# Altium schematic sheet 4V_DIST.SchDoc: My title
size A3; Organization: University of California; Address1: 475 Portola Plaza; Address2: Los Angeles, CA 90095; DocumentNumber: 5; Revision: R01; SheetNumber: 5; SheetTotal: 35
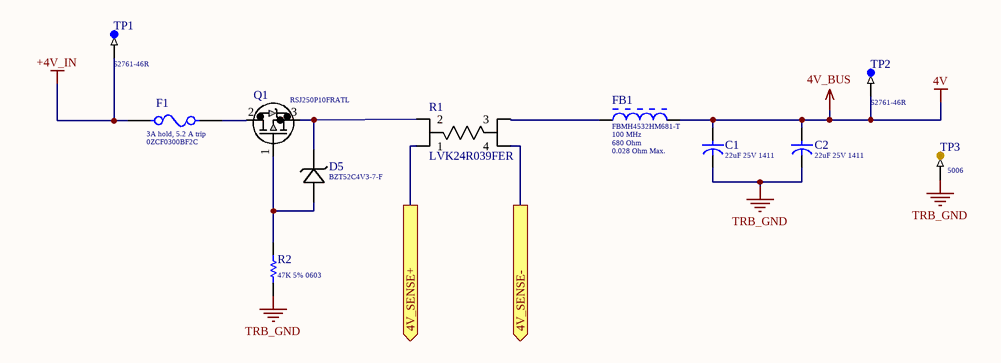
[diagram p0: 4V_DIST.SchDoc]

## Parts
C1  Capacitance: 22uF 25V 1411  [Cap_Kemet_T521B226M025ATE100_22uF]  (hidden comment: Cap_Kemet_T521B226M025ATE100_22uF)
C2  Capacitance: 22uF 25V 1411  [Cap_Kemet_T521B226M025ATE100_22uF]  (hidden comment: Cap_Kemet_T521B226M025ATE100_22uF)
D5  BZT52C4V3-7-F  [SOD123]
F1  3A hold, 5.2 A trip  [Bel_0ZCF_MFG]
FB1  Measuring Frequency: 100 MHz  Nominal Impedance: 680 Ohm  DC Resistance: 0.028 Ohm Max.  [TAYO-FBMH4532-2_V]  (hidden comment: FBMH4532HM681-T)
Q1  Series: RSJ250P10FRATL  [Mos_ROHM_RSJ250P10FRATL_25A]  (hidden comment: Mos_ROHM_RSJ250P10FRATL_25A)
R1  LVK24R039FER  [OH_LVK24_OHM]
R2  47K 5% 0603  [RESC0603(1608)_L]
TP1  Series: S2761-46R  [TP_Harwin_S2761_46R]  (hidden comment: TP_Harwin_S2761_46R)
TP2  Series: S2761-46R  [TP_Harwin_S2761_46R]  (hidden comment: TP_Harwin_S2761_46R)
TP3  Series: 5006  [TP_Keystone_Electronics_5006]  (hidden comment: TP_Keystone_Electronics_5006)

## Ports
4V_SENSE+ (out), 4V_SENSE- (out)

## Nets
4V: C1.1 C2.1 FB1.2 TP2.1  [also labelled 4V_BUS]
+4V_IN: F1.1 TP1.1
TRB_GND: C1.2 C2.2 R2.1 TP3.1
4V_SENSE+: R1.1 ; port 4V_SENSE+
4V_SENSE-: R1.4 ; port 4V_SENSE-
NetD5_1: D5.1 Q1.3(S) R1.2
NetD5_2: D5.2 Q1.1(G) R2.2
NetF1_2: F1.2 Q1.2(D)
NetFB1_1: FB1.1 R1.3

## Notes on the sheet
- 475 Portola Plaza
- GAPS TOF
- igarcia91@g.ucla.edu
- Los Angeles, CA
- 310-825-0344
- Size:
- Date:
- Letter
- Revision:
- Time:
- Sheet
- of
- andrew.peck@cern.ch
- spq@ucla.edu
- File:

## Library data of the parts
C1 C2 = Cap_Kemet_T521B226M025ATE100_22uF: Tantalum Capacitors - Polymer SMD 25V 22uF 1311 20% ESR=100mOhms; Supplier 1: Mouser; Supplier Part Number 1: 80-T521B226M25ATE100
D5 = BZT52C4V3-7-F: Zener Diodes 500mW 4.3V Zener AEC-Q101 Qualified; Vendor: Diodes Inc; Built_By: EMA_UL_Team; Type: DEV; C: Copyright (C) 2015 Accelerated Designs. All rights reserved; Manufacturer_Part_Number: BZT52C4V3-7-F; RefDes: RefDes; Supplier 1: Mouser; Supplier Part Number 1: 621-BZT52C4V3-F; Series: BZT52C4V3-7-F
F1 = 0ZCF0300BF2C: Resettable Fuses - PPTC 3A 24V PPTC 2920 SMD; Supplier 1: Mouser; Supplier 2: Digi-Key; Supplier Part Number 1: 530-0ZCF0300BF2C; Supplier Part Number 2: 507-2072-6-ND; Series: 0ZCF0300BF2C
FB1 = FBMH4532HM681-T: Chip Bead Inductor for Power Lines, 680 Ohm, 4 A, -40 to 125 degC, 2-Pin 4.5 x 3.2 x 3.5 mm SMD, RoHS, Taping; Manufacturer: Taiyo Yuden; Rated Current: 4 A Max.; Impedance Tolerance: +/- 25%; ComponentLink1Description: Manufacturer URL; ComponentLink2Description: Datasheet; DatasheetVersion: 09/2014; ComponentLink3URL: http://www.yuden.co.jp/productdata/catalog/en/chipbeads01_e.pdf; ComponentLink3Description: Package Specification; ComponentLink1URL: http://www.t-yuden.com/; Mounting Technology: Surface Mount; Packing: Taping; Temperature Range: -40 to 125 degC; PartNumber: FBMH4532HM681-T; PackageDescription: 2-Pin Surface Mount Device, Body 4.5 x 3.2 mm, Height 3.5 mm; ComponentLink2URL: http://www.yuden.co.jp/productdata/catalog/en/chipbeads01_e.pdf; RoHS: TRUE; Supplier 1: Digi-Key; Supplier Part Number 1: 587-1761-6-ND
Q1 = Mos_ROHM_RSJ250P10FRATL_25A: MOSFET Pch -100V Vds -25A 0.05Rds(on) 60Qg; Supplier 1: Mouser; Supplier Part Number 1: 755-RSJ250P10FRATL
R1 = LVK24R039FER: RES 0.039 OHM 1% 1W 2412; Vendor: Ohmite; Built_By: EMA_UL_Team; SourceLibrary: Ohmite_2014-12-31; Manufacturer_Part_Number: LVK24R039FER; Copyright: Copyright (C) 2018 Accelerated Designs. All rights reserved; RefDes: RefDes; Type: DEV
R2 = CMP-1012-00114-1: 47K 0.1W 5% 0603 (1608 Metric)  SMD; Case-EIA: 0603; Value: 47000.00 Ohm; Case-Metric: 1608; Tolerance: 5 %; Power: 0.1 W; Technology: SMT
TP1 TP2 = TP_Harwin_S2761_46R: Circuit Board Hardware - PCB SMT Mini Test Terminal, Reel; Supplier 1: Newark; Supplier Part Number 1: 76Y5391
TP3 = TP_Keystone_Electronics_5006: Circuit Board Hardware - PCB TEST POINT BLK .063; Supplier 1: Mouser; Supplier Part Number 1: 534-5006